# EAGLE design angle (EAGLE 9.3.0)
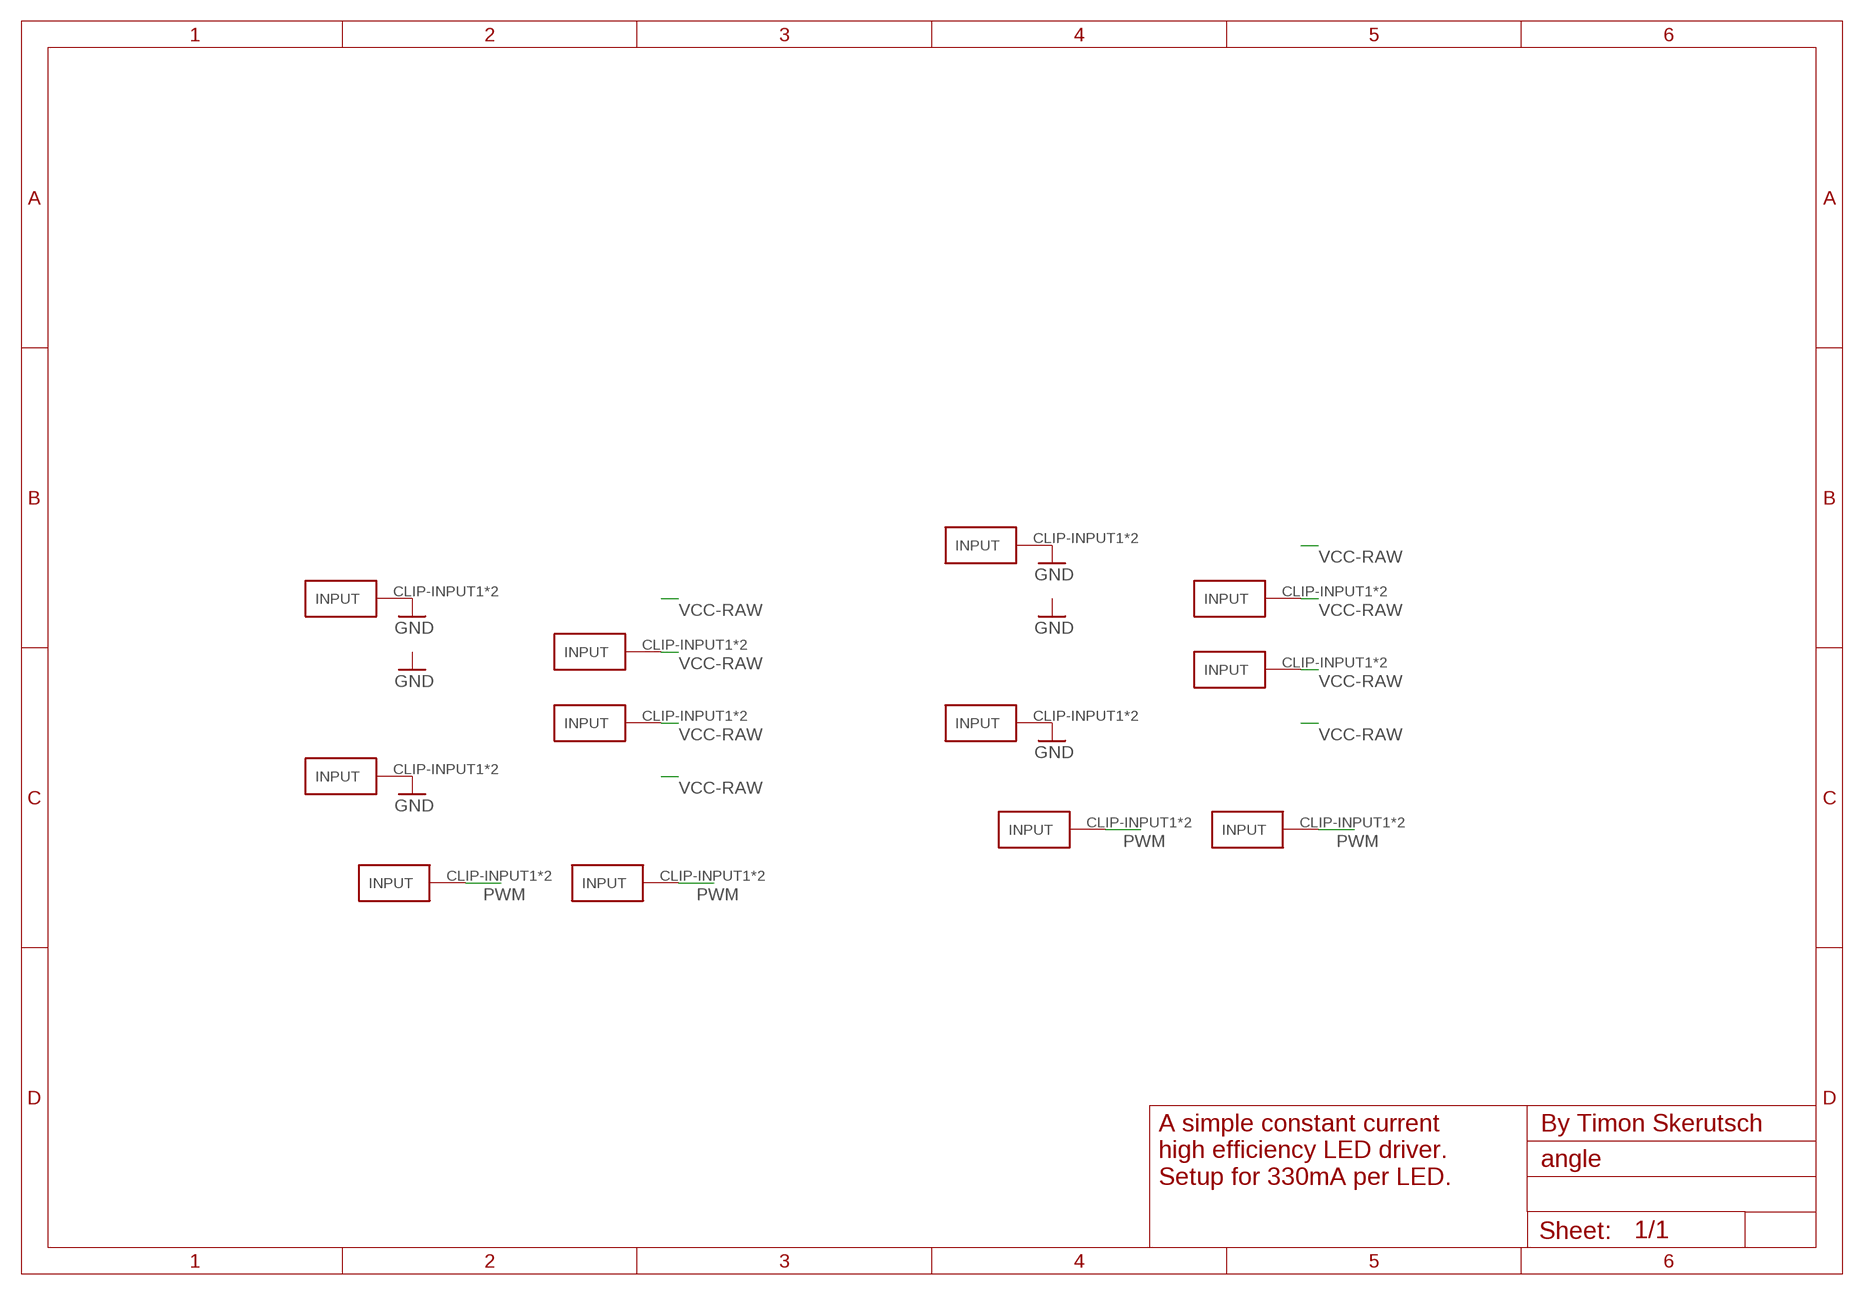
[diagram p0: schematic, sheet 1]

## Parts
GND-CLIP  FUSE-HOLDER-5X20MM  [FUSE-HOLDER-5X20MM]
GND-CLIP1  FUSE-HOLDER-5X20MM  [FUSE-HOLDER-5X20MM]
GND-CLIP2  FUSE-HOLDER-5X20MM  [FUSE-HOLDER-5X20MM]
GND-CLIP3  FUSE-HOLDER-5X20MM  [FUSE-HOLDER-5X20MM]
PWM-CLIP  FUSE-HOLDER-5X20MM  [FUSE-HOLDER-5X20MM]
PWM-CLIP1  FUSE-HOLDER-5X20MM  [FUSE-HOLDER-5X20MM]
PWM-CLIP2  FUSE-HOLDER-5X20MM  [FUSE-HOLDER-5X20MM]
PWM-CLIP3  FUSE-HOLDER-5X20MM  [FUSE-HOLDER-5X20MM]
VCC-CLIP  FUSE-HOLDER-5X20MM  [FUSE-HOLDER-5X20MM]
VCC-CLIP1  FUSE-HOLDER-5X20MM  [FUSE-HOLDER-5X20MM]
VCC-CLIP2  FUSE-HOLDER-5X20MM  [FUSE-HOLDER-5X20MM]
VCC-CLIP3  FUSE-HOLDER-5X20MM  [FUSE-HOLDER-5X20MM]

## Nets
GND: GND-CLIP1.CLIP-INPUT1(INPUT) GND-CLIP1.CLIP-INPUT2(INPUT) GND-CLIP2.CLIP-INPUT1(INPUT) GND-CLIP2.CLIP-INPUT2(INPUT) GND-CLIP3.CLIP-INPUT1(INPUT) GND-CLIP3.CLIP-INPUT2(INPUT) GND-CLIP.CLIP-INPUT1(INPUT) GND-CLIP.CLIP-INPUT2(INPUT)
PWM: PWM-CLIP1.CLIP-INPUT1(INPUT) PWM-CLIP1.CLIP-INPUT2(INPUT) PWM-CLIP2.CLIP-INPUT1(INPUT) PWM-CLIP2.CLIP-INPUT2(INPUT) PWM-CLIP3.CLIP-INPUT1(INPUT) PWM-CLIP3.CLIP-INPUT2(INPUT) PWM-CLIP.CLIP-INPUT1(INPUT) PWM-CLIP.CLIP-INPUT2(INPUT)
VCC-RAW [VCC]: VCC-CLIP1.CLIP-INPUT1(INPUT) VCC-CLIP1.CLIP-INPUT2(INPUT) VCC-CLIP2.CLIP-INPUT1(INPUT) VCC-CLIP2.CLIP-INPUT2(INPUT) VCC-CLIP3.CLIP-INPUT1(INPUT) VCC-CLIP3.CLIP-INPUT2(INPUT) VCC-CLIP.CLIP-INPUT1(INPUT) VCC-CLIP.CLIP-INPUT2(INPUT)

## Notes on the sheet
- By Timon Skerutsch
- A simple constant current
  high efficiency LED driver.
  Setup for 330mA per LED.

## Library data of the parts
GND-CLIP GND-CLIP1-GND-CLIP3 PWM-CLIP PWM-CLIP1-PWM-CLIP3 VCC-CLIP VCC-CLIP1-VCC-CLIP3 = timon-diverses:FUSE-HOLDER-5X20MM

## Net classes
1 VCC: clearance 0.508 mm

## Board
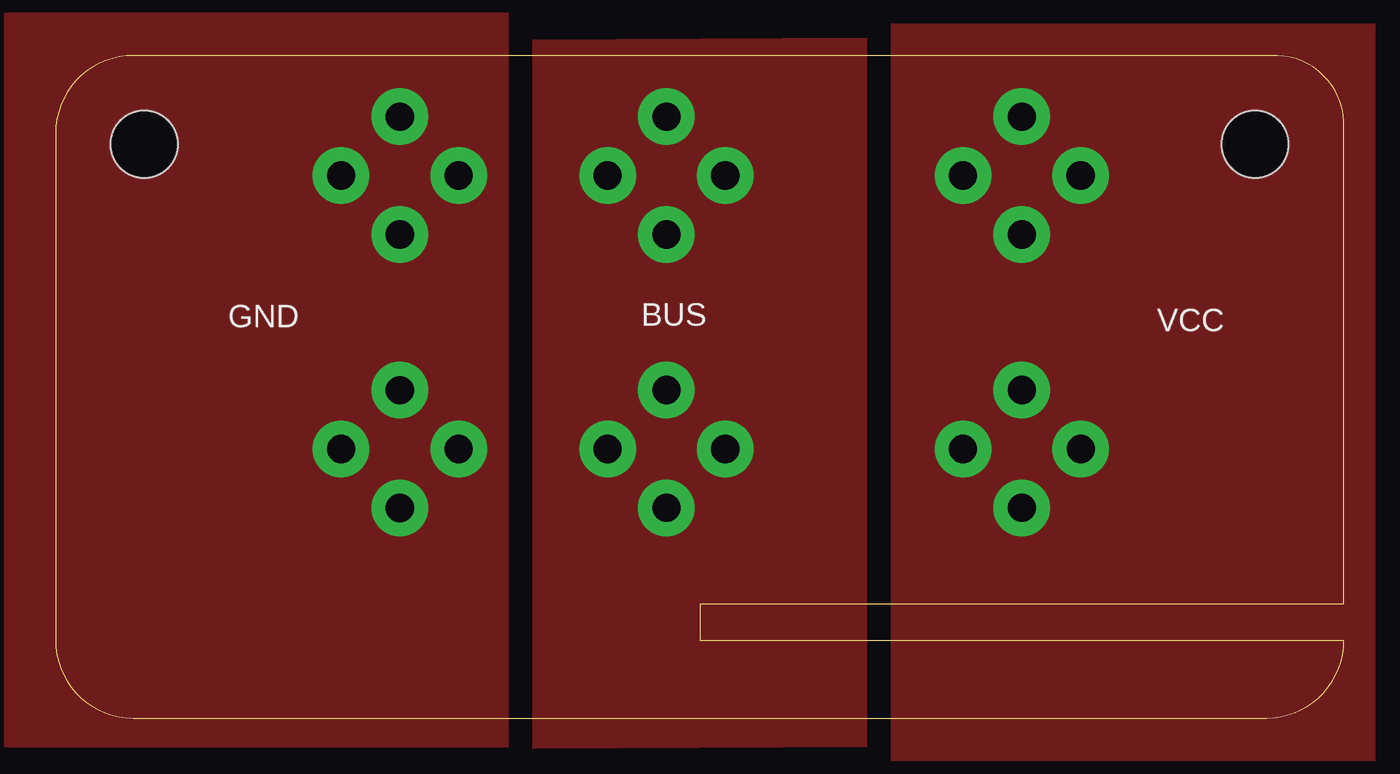
[diagram p1: board, top side]
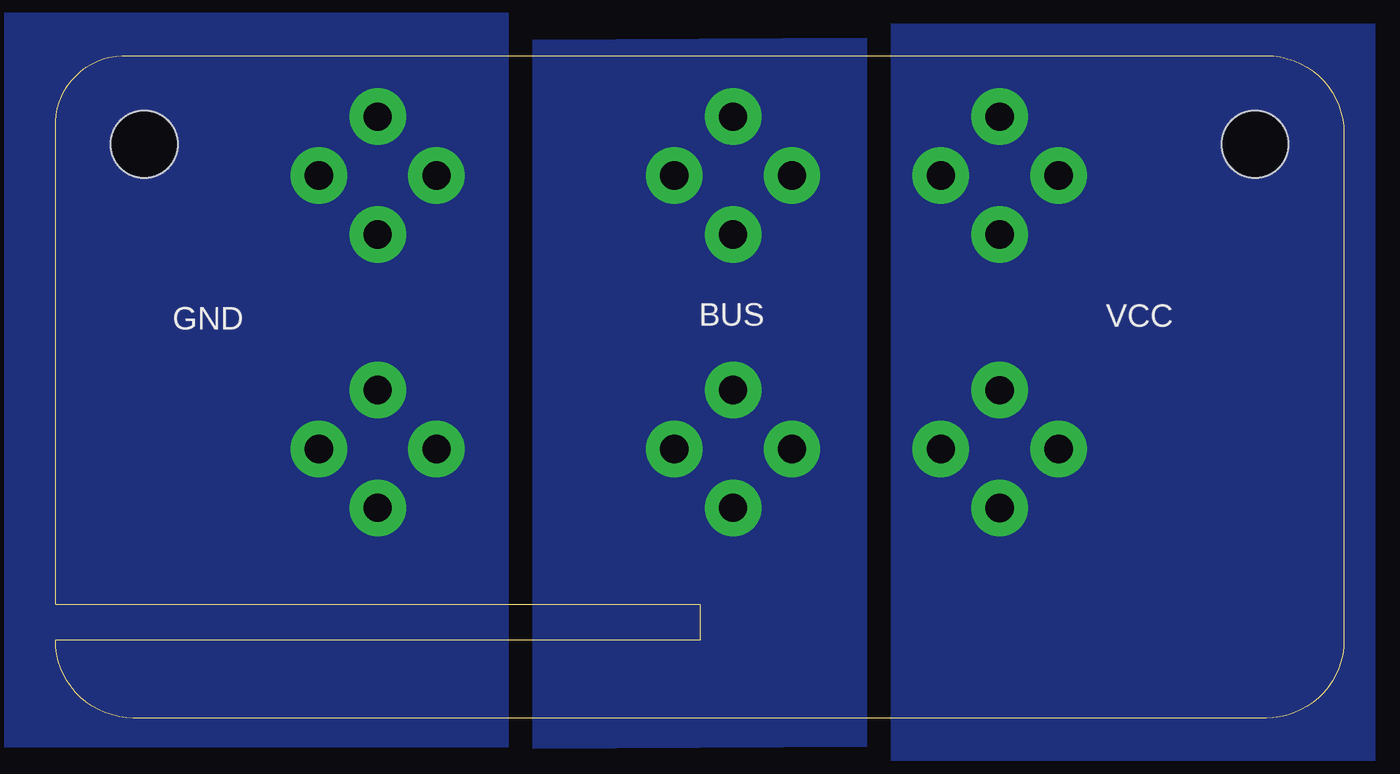
[diagram p2: board, bottom side, seen from below]

Size 58 x 29.81 mm. Coordinates in mm from the lower left corner, seen from the top.
Outline: 54.5,0 arc90 58,3.51 29,3.51 29,5.11 58,5.11 58,26.56 arc90 55.01,29.81 3.5,29.81 arc90 0,26.31 0,3.5 arc90 3.5,0 54.5,0
Copper layers (1*16): Top 0.035mm / dielectric 1.5mm / Bottom 0.035mm
Design rules "led_module *": minimum track width 8mil, minimum drill 1mm, track to track 1mm, track to pad 1mm, pad to pad 1mm, via to via 1mm, smd to smd 0mil, copper to edge 0mil, drill to drill 1mil, minimum pad ring 10mil, minimum via ring 10mil, stop-mask expansion 1mil, vias tented up to drill 30mil, thermal gap 10mil
Holes 3 mm at 4,25.81 54,25.81

### Footprints (pad centres in the part's own frame; a part is rotated, then mirrored left to right if it is on the bottom)
FUSE-HOLDER-5X20MM = drill 1.27 pad 2.54: CLIP-INPUT1 -2.65,0; CLIP-INPUT2 2.65,0

### Placement (x,y rotation side)
GND-CLIP  43.5,12.11 0 top
GND-CLIP1  43.5,24.41 0 top
GND-CLIP2  43.5,24.41 90 top
GND-CLIP3  43.5,12.11 90 top
PWM-CLIP  27.5,12.11 0 top
PWM-CLIP1  27.5,12.11 90 top
PWM-CLIP2  27.5,24.41 0 top
PWM-CLIP3  27.5,24.41 90 top
VCC-CLIP  15.5,12.11 0 top
VCC-CLIP1  15.5,24.41 0 top
VCC-CLIP2  15.5,24.41 90 top
VCC-CLIP3  15.5,12.1 270 bottom

### Tracks (layer width: path | path; a pad name or v marks a point on that pad's centre or on a via)
GND
  pour Top (no thermals): 59.4,31.21 37.6,31.21 37.6,-1.89 59.4,-1.89
  pour Bottom (no thermals): 60.3,31.71 60.3,-1.29 37.6,-1.29 37.6,31.71
PWM
  pour Top (no thermals): 36.5,30.61 36.5,-1.29 21.5,-1.39 21.5,30.51
  pour Bottom (no thermals): 21.5,30.61 21.5,-1.29 36.5,-1.39 36.5,30.51
VCC-RAW
  pour Top (no thermals): -2.3,31.71 -2.3,-1.29 20.4,-1.29 20.4,31.71
  pour Bottom (no thermals): -1.4,31.21 20.4,31.21 20.4,-1.89 -1.4,-1.89

### Text on the board
tNames: BUS | GND | VCC
bNames: BUS | VCC | GND